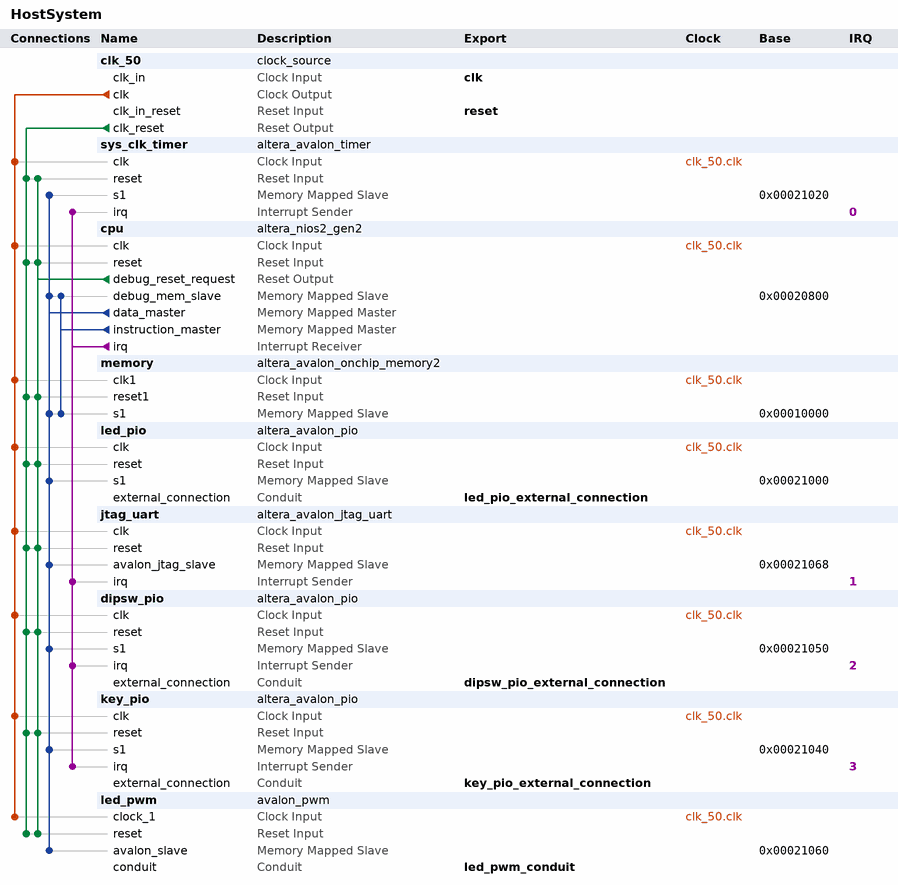
[diagram p0: system contents]
# Platform Designer (Qsys) system HostSystem, Cyclone V 5CSEBA6U23I7
# Parameters at their usual value, and those the tool derives, are not listed.
package require -exact qsys 18.0
create_system HostSystem
set_project_property DEVICE_FAMILY {Cyclone V}
set_project_property DEVICE 5CSEBA6U23I7

add_instance clk_50 clock_source 18.0
set_instance_parameter_value clk_50 clockFrequency 50000000

add_instance sys_clk_timer altera_avalon_timer 18.0
set_instance_parameter_value sys_clk_timer period 1
set_instance_parameter_value sys_clk_timer periodUnits MSEC

add_instance cpu altera_nios2_gen2 18.0
set_instance_parameter_value cpu dcache_size 2048
set_instance_parameter_value cpu exceptionSlave memory.s1
set_instance_parameter_value cpu icache_size 4096
set_instance_parameter_value cpu impl Tiny
set_instance_parameter_value cpu resetSlave memory.s1

add_instance memory altera_avalon_onchip_memory2 18.0
set_instance_parameter_value memory dataWidth 32
set_instance_parameter_value memory dualPort false
set_instance_parameter_value memory initMemContent true
set_instance_parameter_value memory initializationFileName onchip_mem.hex
set_instance_parameter_value memory memorySize 65536

add_instance led_pio altera_avalon_pio 18.0
set_instance_parameter_value led_pio bitModifyingOutReg true
set_instance_parameter_value led_pio direction Output
set_instance_parameter_value led_pio resetValue 5
set_instance_parameter_value led_pio width 8

add_instance jtag_uart altera_avalon_jtag_uart 18.0
set_instance_parameter_value jtag_uart simInteractiveOptions NO_INTERACTIVE_WINDOWS

add_instance dipsw_pio altera_avalon_pio 18.0
set_instance_parameter_value dipsw_pio direction Input
set_instance_parameter_value dipsw_pio generateIRQ true
set_instance_parameter_value dipsw_pio width 4

add_instance key_pio altera_avalon_pio 18.0
set_instance_parameter_value key_pio captureEdge true
set_instance_parameter_value key_pio direction Input
set_instance_parameter_value key_pio edgeType FALLING
set_instance_parameter_value key_pio generateIRQ true
set_instance_parameter_value key_pio irqType EDGE
set_instance_parameter_value key_pio simDoTestBenchWiring true
set_instance_parameter_value key_pio simDrivenValue 1
set_instance_parameter_value key_pio width 2

add_instance led_pwm avalon_pwm 2015.5
set_instance_parameter_value led_pwm debug 0
set_instance_parameter_value led_pwm duty_default 0
set_instance_parameter_value led_pwm modulus_default 0

# connections
add_connection clk_50.clk cpu.clk clock
add_connection clk_50.clk dipsw_pio.clk clock
add_connection clk_50.clk jtag_uart.clk clock
add_connection clk_50.clk key_pio.clk clock
add_connection clk_50.clk led_pio.clk clock
add_connection clk_50.clk led_pwm.clock_1 clock
add_connection clk_50.clk memory.clk1 clock
add_connection clk_50.clk sys_clk_timer.clk clock
add_connection clk_50.clk_reset cpu.reset reset
add_connection clk_50.clk_reset dipsw_pio.reset reset
add_connection clk_50.clk_reset jtag_uart.reset reset
add_connection clk_50.clk_reset key_pio.reset reset
add_connection clk_50.clk_reset led_pio.reset reset
add_connection clk_50.clk_reset led_pwm.reset reset
add_connection clk_50.clk_reset memory.reset1 reset
add_connection clk_50.clk_reset sys_clk_timer.reset reset
add_connection cpu.debug_reset_request cpu.reset reset
add_connection cpu.debug_reset_request dipsw_pio.reset reset
add_connection cpu.debug_reset_request jtag_uart.reset reset
add_connection cpu.debug_reset_request key_pio.reset reset
add_connection cpu.debug_reset_request led_pio.reset reset
add_connection cpu.debug_reset_request led_pwm.reset reset
add_connection cpu.debug_reset_request memory.reset1 reset
add_connection cpu.debug_reset_request sys_clk_timer.reset reset
add_connection cpu.data_master cpu.debug_mem_slave avalon
set_connection_parameter_value cpu.data_master/cpu.debug_mem_slave baseAddress 0x00020800
add_connection cpu.data_master dipsw_pio.s1 avalon
set_connection_parameter_value cpu.data_master/dipsw_pio.s1 baseAddress 0x00021050
add_connection cpu.data_master jtag_uart.avalon_jtag_slave avalon
set_connection_parameter_value cpu.data_master/jtag_uart.avalon_jtag_slave baseAddress 0x00021068
add_connection cpu.data_master key_pio.s1 avalon
set_connection_parameter_value cpu.data_master/key_pio.s1 baseAddress 0x00021040
add_connection cpu.data_master led_pio.s1 avalon
set_connection_parameter_value cpu.data_master/led_pio.s1 baseAddress 0x00021000
add_connection cpu.data_master led_pwm.avalon_slave avalon
set_connection_parameter_value cpu.data_master/led_pwm.avalon_slave baseAddress 0x00021060
add_connection cpu.data_master memory.s1 avalon
set_connection_parameter_value cpu.data_master/memory.s1 baseAddress 0x00010000
add_connection cpu.data_master sys_clk_timer.s1 avalon
set_connection_parameter_value cpu.data_master/sys_clk_timer.s1 baseAddress 0x00021020
add_connection cpu.instruction_master cpu.debug_mem_slave avalon
set_connection_parameter_value cpu.instruction_master/cpu.debug_mem_slave baseAddress 0x00020800
add_connection cpu.instruction_master memory.s1 avalon
set_connection_parameter_value cpu.instruction_master/memory.s1 baseAddress 0x00010000
add_connection cpu.irq dipsw_pio.irq interrupt
set_connection_parameter_value cpu.irq/dipsw_pio.irq irqNumber 2
add_connection cpu.irq jtag_uart.irq interrupt
set_connection_parameter_value cpu.irq/jtag_uart.irq irqNumber 1
add_connection cpu.irq key_pio.irq interrupt
set_connection_parameter_value cpu.irq/key_pio.irq irqNumber 3
add_connection cpu.irq sys_clk_timer.irq interrupt
set_connection_parameter_value cpu.irq/sys_clk_timer.irq irqNumber 0

# exported interfaces
add_interface clk clock sink
set_interface_property clk EXPORT_OF clk_50.clk_in
add_interface dipsw_pio_external_connection conduit end
set_interface_property dipsw_pio_external_connection EXPORT_OF dipsw_pio.external_connection
add_interface key_pio_external_connection conduit end
set_interface_property key_pio_external_connection EXPORT_OF key_pio.external_connection
add_interface led_pio_external_connection conduit end
set_interface_property led_pio_external_connection EXPORT_OF led_pio.external_connection
add_interface led_pwm_conduit conduit end
set_interface_property led_pwm_conduit EXPORT_OF led_pwm.conduit
add_interface reset reset sink
set_interface_property reset EXPORT_OF clk_50.clk_in_reset

set_interconnect_requirement {$system} qsys_mm.clockCrossingAdapter HANDSHAKE
set_interconnect_requirement {$system} qsys_mm.enableEccProtection FALSE
set_interconnect_requirement {$system} qsys_mm.insertDefaultSlave FALSE
set_interconnect_requirement {$system} qsys_mm.maxAdditionalLatency 1

save_system HostSystem.qsys
